# Altium project SpoolBot_drive_PCB.PrjPcb
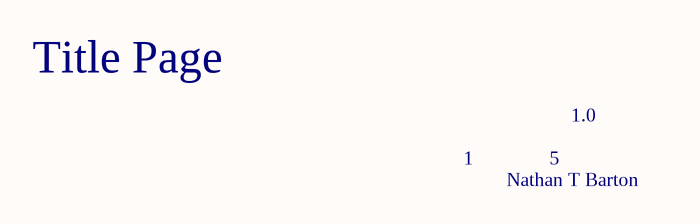
[diagram p0: SpoolBot_drive_PCB.SchDoc]
5 sheets, 36 parts. Net scope: global (net labels, ports and power ports of the same name join across sheets).
Board file: SpoolBot_drive_PCB.PcbDoc
Sheets:
  SpoolBot_drive_PCB.SchDoc
  DRV8840_driver.SchDoc
  Power_regulator.SchDoc
  MCU_ATmega4809.SchDoc
  Connectors.SchDoc

## Sheet SpoolBot_drive_PCB.SchDoc
size A; DocumentNumber: 1; SheetNumber: 1; SheetTotal: 5

### Notes on the sheet
- Title Page
- 1
- 5
- 1.0
- Nathan T Barton

## Sheet DRV8840_driver.SchDoc: Motor Driver
size A; DocumentNumber: 2; SheetNumber: 2; SheetTotal: 5
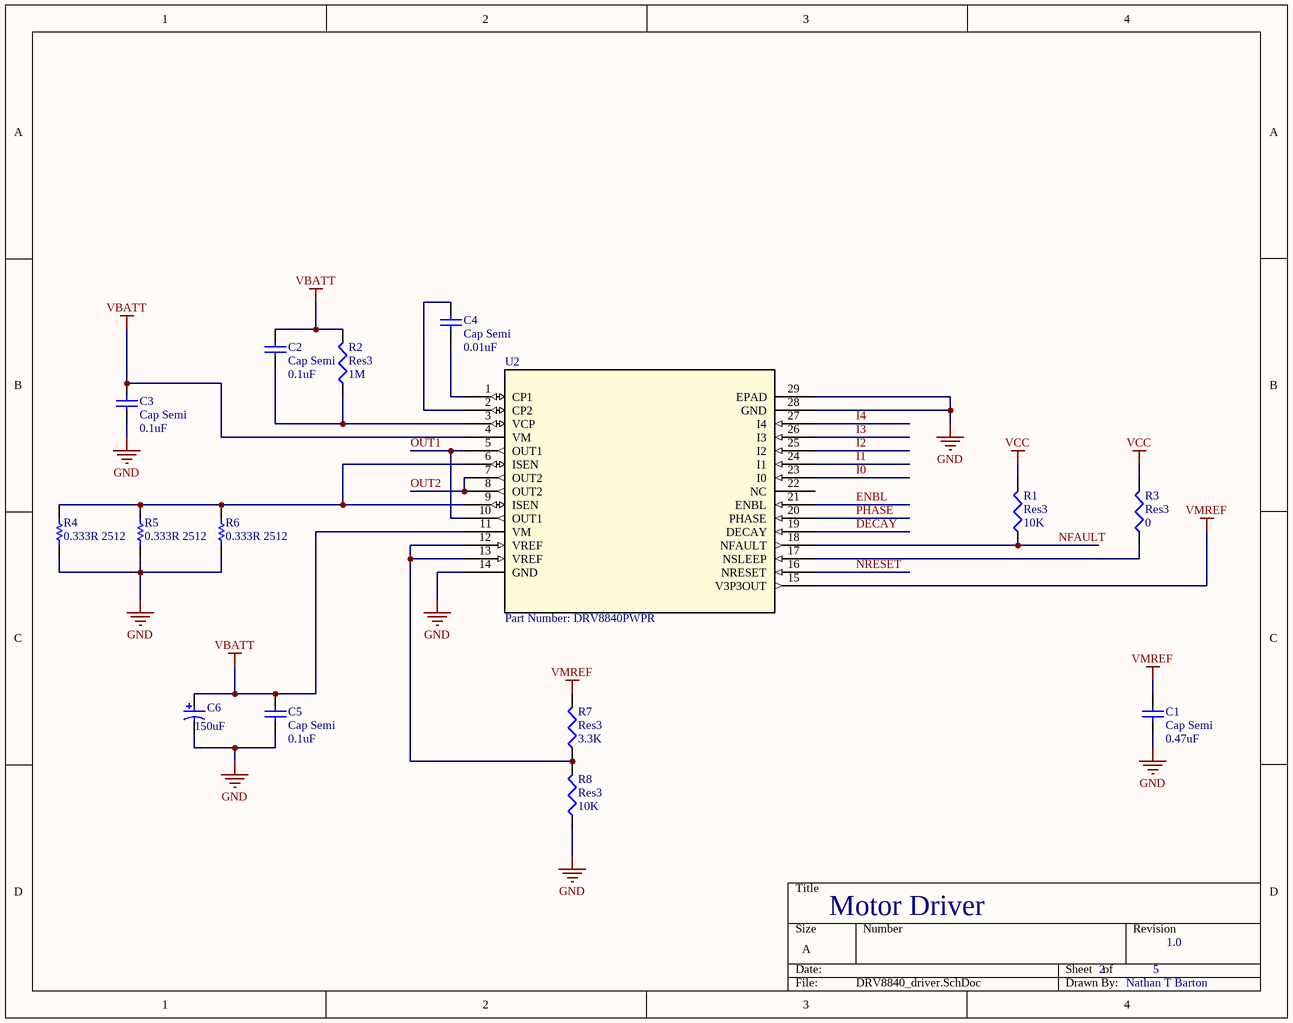
[diagram p1: DRV8840_driver.SchDoc]

### Parts
C1  Cap Semi  value 0.47uF  [C1206]
C2  Cap Semi  value 0.1uF  [C1206]
C3  Cap Semi  value 0.1uF  [C1206]
C4  Cap Semi  value 0.01uF  [C1206]
C5  Cap Semi  value 0.1uF  [C1206]
C6  150uF  [NIC-CAPA2-10X10_V]
R1  Res3  value 10K  [J1-0603]
R2  Res3  value 1M  [J1-0603]
R3  Res3  value 0  [J1-0603]
R4  0.333R 2512  [RESC2512(6432)_M]
R5  0.333R 2512  [RESC2512(6432)_M]
R6  0.333R 2512  [RESC2512(6432)_M]
R7  Res3  value 3.3K  [J1-0603]
R8  Res3  value 10K  [J1-0603]
U2  Part Number: DRV8840PWPR  [PWP28_5P18X3P1]

### Nets
GND: C1.1 C3.1 C5.1 C6.2 R4.1 R5.1 R6.1 R8.1 U2.14(GND) U2.28(GND) U2.29(EPAD)
VBATT: C2.2 C3.2 C5.2 C6.1 R2.2 U2.4(VM) U2.11(VM)
VCC: R1.2 R3.2
VMREF: C1.2 R7.2 U2.15(V3P3OUT)
DECAY: U2.19(DECAY)
ENBL: U2.21(ENBL)
I0: U2.23(I0)
I1: U2.24(I1)
I2: U2.25(I2)
I3: U2.26(I3)
I4: U2.27(I4)
NFAULT: R1.1 U2.18(NFAULT)
NRESET: U2.16(NRESET)
OUT1: U2.5(OUT1) U2.10(OUT1)
OUT2: U2.7(OUT2) U2.8(OUT2)
PHASE: U2.20(PHASE)
NetC2_1: C2.1 R2.1 U2.3(VCP)
NetC4_1: C4.1 U2.1(CP1)
NetC4_2: C4.2 U2.2(CP2)
NetR3_1: R3.1 U2.17(NSLEEP)
NetR4_2: R4.2 R5.2 R6.2 U2.6(ISEN) U2.9(ISEN)
NetR7_1: R7.1 R8.2 U2.12(VREF) U2.13(VREF)

Not connected (* = marked no-connect by the designer): U2 22(NC)

### Notes on the sheet
- Motor Driver
- 2
- 5
- 1.0
- Nathan T Barton

### Library data of the parts
C1-C5 = Cap Semi: Capacitor (Semiconductor SIM Model); Published: 8-Jun-2000; LatestRevisionDate: 29-May-2009; LatestRevisionNote: IPC-7351 Footprint Added.; PackageReference: C1206; Publisher: Altium Limited; PackageDescription: Chip Capacitor
C6 = CMP-0687-00003-1: Aluminum Electrolytic Capacitor, UD Series, Low Impedance, 150 uF, 50 V, + / - 20%, -55 to 105 degC, Chip Type, 10 x 10 mm D x L, Pb-Free, Reel; Manufacturer: Nichicon; PartNumber: UUD1H151MNL1GS; Rated Ripple Current (at 100kHz): 670 mA; Impedance: 0.18 Ohm; Packing: Dia382mm Reel; Tolerance Rated Capacitance: -20 to 20%; Rated Voltage: 50 V; Endurance Time: 5000 h; ComponentLink3URL: http://products.nichicon.co.jp/en/pdf/XJA043/e-ud.pdf; ComponentLink1URL: http://www.nichicon.co.jp/; ComponentLink2Description: Datasheet; Diameter: 10 mm; Rated Capacitance: 150 uF; ComponentLink3Description: Package Specification; PackageDescription: 2-Pin Surface Mount Device, Diameter 10 mm, Height 10 mm, Pitch 8 mm; ComponentLink1Description: Manufacturer URL; DatasheetVersion: 08/2012; Length: 10 mm; PackageReference: CAPAE-D10H10; RoHS: TRUE; Mounting Technology: Surface Mount; ComponentLink2URL: http://products.nichicon.co.jp/en/pdf/XJA043/e-ud.pdf
R1-R3 R7 R8 = Res3: Resistor; Published: 8-Jun-2000; LatestRevisionDate: 29-May-2009; LatestRevisionNote: IPC-7351 Footprint Added.; PackageReference: J1-0603; Publisher: Altium Limited; PackageDescription: Chip Resistor
R4-R6 = CMP-1018-00171-1: 1R 1W 1% 2512 (6432 Metric)  SMD; Case-EIA: 2512; Value: 1.00 Ohm; Case-Metric: 6432; Tolerance: 1 %; Technology: SMT; Power: 1 W
U2 = DRV8840PWPR: No Description Available; Manufacturer: Texas Instruments; Built_By: EMA_UL_Team; Vendor: Texas Instruments; Manufacturer_Part_Number: DRV8840PWPR; Copyright: Copyright (C) 2018 Accelerated Designs. All rights reserved; RefDes: RefDes; Type: DEV; Value: Value

## Sheet Power_regulator.SchDoc
size A; DocumentNumber: 3; SheetNumber: 3; SheetTotal: 5
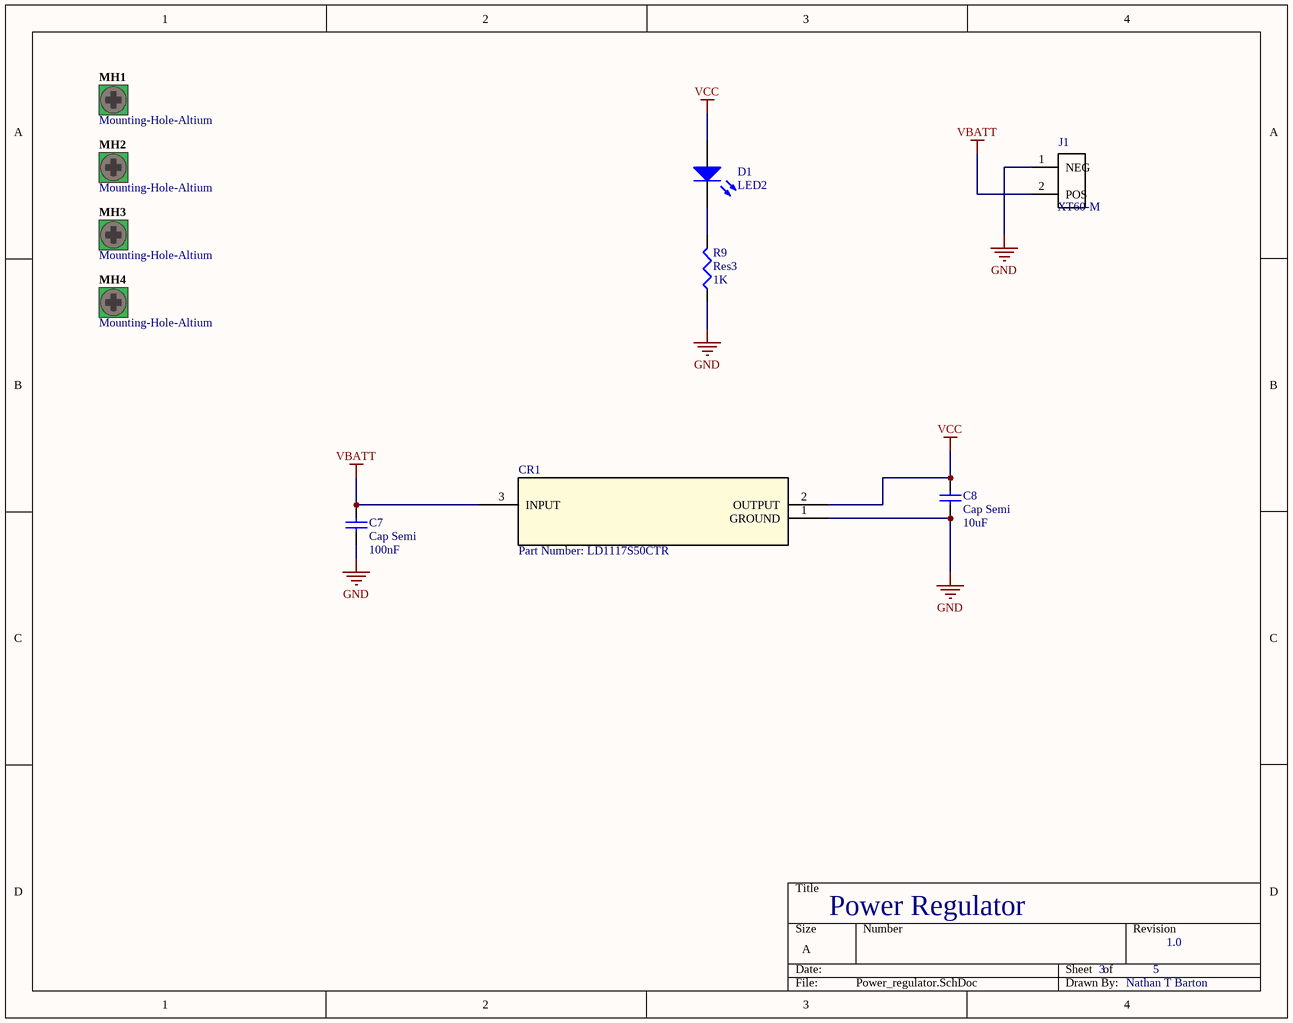
[diagram p2: Power_regulator.SchDoc]

### Parts
C7  Cap Semi  value 100nF  [C1206]
C8  Cap Semi  value 10uF  [C1206]
CR1  Part Number: LD1117S50CTR  [SOT-223]
D1  LED2  [3.2X1.6X1.1]
J1  XT60-M  [*AMASS_XT60-M]
MH1  Mounting-Hole-Altium  [Mounting-Hole-Altium]  (no BOM)
MH2  Mounting-Hole-Altium  [Mounting-Hole-Altium]  (no BOM)
MH3  Mounting-Hole-Altium  [Mounting-Hole-Altium]  (no BOM)
MH4  Mounting-Hole-Altium  [Mounting-Hole-Altium]  (no BOM)
R9  Res3  value 1K  [J1-0603]

### Nets
GND: C7.1 C8.1 CR1.1(GROUND) J1.1(NEG) R9.1
VBATT: C7.2 CR1.3(INPUT) J1.2(POS)
VCC: C8.2 CR1.2(OUTPUT) D1.1(A)
NetD1_2: D1.2(K) R9.2

Not connected (* = marked no-connect by the designer): MH1 1; MH2 1; MH3 1; MH4 1

### Notes on the sheet
- Power Regulator
- 3
- 5
- 1.0
- Nathan T Barton

### Library data of the parts
C7 C8 = Cap Semi: Capacitor (Semiconductor SIM Model); Published: 8-Jun-2000; LatestRevisionDate: 29-May-2009; LatestRevisionNote: IPC-7351 Footprint Added.; PackageReference: C1206; Publisher: Altium Limited; PackageDescription: Chip Capacitor
CR1 = LD1117S50CTR: No Description Available; Vendor: STMicroelectronics; Built_By: EMA_UL_Team; Type: DEV; Manufacturer_Part_Number: LD1117S50CTR; Copyright: Copyright (C) 2018 Accelerated Designs. All rights reserved; RefDes: RefDes; Value: Value
D1 = LED2: Typical RED, GREEN, YELLOW, AMBER GaAs LED; Published: 8-Jun-2000; LatestRevisionDate: 17-Jul-2002; LatestRevisionNote: Re-released for DXP Platform.; PackageVersion: Feb-2002; PackageReference: 3.2X1.6X1.1; Publisher: Altium Limited; PackageDescription: SM LED; 2 Flat Leads
J1 = XT60-M: MF: AMASS; Availability: Unavailable; Package: Package Analog Devices; SnapEDA_Link: https://www.snapeda.com/parts/XT60-M/AMASS/view-part/?ref=snap; MP: XT60-M; Price: None; Value: *
MH1-MH4 = CMP-0001-00027-1: Mounting Hole, Altium, 3.8mm pad, 3.4mm plated hole; ClassName: Mounting Hole; Publisher: Altium
R9 = Res3: Resistor; Published: 8-Jun-2000; LatestRevisionDate: 29-May-2009; LatestRevisionNote: IPC-7351 Footprint Added.; PackageReference: J1-0603; Publisher: Altium Limited; PackageDescription: Chip Resistor

## Sheet MCU_ATmega4809.SchDoc
size A; DocumentNumber: 4; SheetNumber: 4; SheetTotal: 5
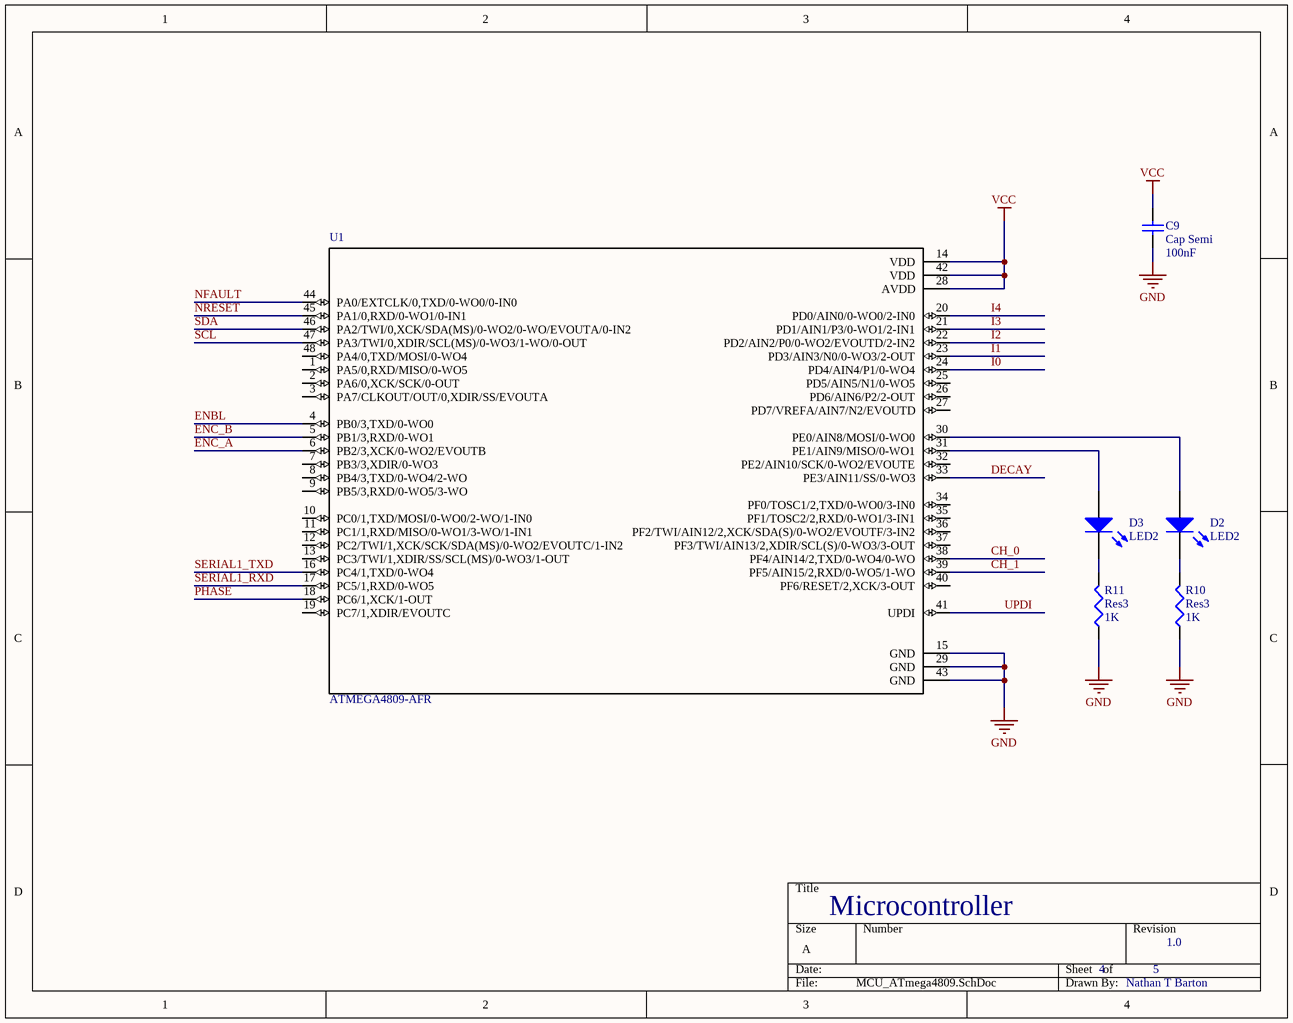
[diagram p3: MCU_ATmega4809.SchDoc]

### Parts
C9  Cap Semi  value 100nF  [C1206]
D2  LED2  [3.2X1.6X1.1]
D3  LED2  [3.2X1.6X1.1]
R10  Res3  value 1K  [J1-0603]
R11  Res3  value 1K  [J1-0603]
U1  ATMEGA4809-AFR  [*QFP50P900X900X120-48N]

### Nets
GND: C9.1 R10.1 R11.1 U1.15(GND) U1.29(GND) U1.43(GND)
VCC: C9.2 U1.14(VDD) U1.28(AVDD) U1.42(VDD)
CH_0: U1.38(PF4/AIN14/2,TXD/0-WO4/0-WO)
CH_1: U1.39(PF5/AIN15/2,RXD/0-WO5/1-WO)
DECAY: U1.33(PE3/AIN11/SS/0-WO3)
ENBL: U1.4(PB0/3,TXD/0-WO0)
ENC_A: U1.6(PB2/3,XCK/0-WO2/EVOUTB)
ENC_B: U1.5(PB1/3,RXD/0-WO1)
I0: U1.24(PD4/AIN4/P1/0-WO4)
I1: U1.23(PD3/AIN3/N0/0-WO3/2-OUT)
I2: U1.22(PD2/AIN2/P0/0-WO2/EVOUTD/2-IN2)
I3: U1.21(PD1/AIN1/P3/0-WO1/2-IN1)
I4: U1.20(PD0/AIN0/0-WO0/2-IN0)
NFAULT: U1.44(PA0/EXTCLK/0,TXD/0-WO0/0-IN0)
NRESET: U1.45(PA1/0,RXD/0-WO1/0-IN1)
PHASE: U1.18(PC6/1,XCK/1-OUT)
SCL: U1.47(PA3/TWI/0,XDIR/SCL(MS)/0-WO3/1-WO/0-OUT)
SDA: U1.46(PA2/TWI/0,XCK/SDA(MS)/0-WO2/0-WO/EVOUTA/0-IN2)
SERIAL1_RXD: U1.17(PC5/1,RXD/0-WO5)
SERIAL1_TXD: U1.16(PC4/1,TXD/0-WO4)
UPDI: U1.41(UPDI)
NetD2_1: D2.1(A) U1.30(PE0/AIN8/MOSI/0-WO0)
NetD2_2: D2.2(K) R10.2
NetD3_1: D3.1(A) U1.31(PE1/AIN9/MISO/0-WO1)
NetD3_2: D3.2(K) R11.2

Not connected (* = marked no-connect by the designer): U1 1(PA5/0,RXD/MISO/0-WO5) 2(PA6/0,XCK/SCK/0-OUT) 3(PA7/CLKOUT/OUT/0,XDIR/SS/EVOUTA) 7(PB3/3,XDIR/0-WO3) 8(PB4/3,TXD/0-WO4/2-WO) 9(PB5/3,RXD/0-WO5/3-WO) 10(PC0/1,TXD/MOSI/0-WO0/2-WO/1-IN0) 11(PC1/1,RXD/MISO/0-WO1/3-WO/1-IN1) 12(PC2/TWI/1,XCK/SCK/SDA(MS)/0-WO2/EVOUTC/1-IN2) 13(PC3/TWI/1,XDIR/SS/SCL(MS)/0-WO3/1-OUT) 19(PC7/1,XDIR/EVOUTC) 25(PD5/AIN5/N1/0-WO5) 26(PD6/AIN6/P2/2-OUT) 27(PD7/VREFA/AIN7/N2/EVOUTD) 32(PE2/AIN10/SCK/0-WO2/EVOUTE) 34(PF0/TOSC1/2,TXD/0-WO0/3-IN0) 35(PF1/TOSC2/2,RXD/0-WO1/3-IN1) 36(PF2/TWI/AIN12/2,XCK/SDA(S)/0-WO2/EVOUTF/3-IN2) 37(PF3/TWI/AIN13/2,XDIR/SCL(S)/0-WO3/3-OUT) 40(PF6/RESET/2,XCK/3-OUT) 48(PA4/0,TXD/MOSI/0-WO4)

### Notes on the sheet
- Microcontroller
- 4
- 5
- 1.0
- Nathan T Barton

### Library data of the parts
C9 = Cap Semi: Capacitor (Semiconductor SIM Model); Published: 8-Jun-2000; LatestRevisionDate: 29-May-2009; LatestRevisionNote: IPC-7351 Footprint Added.; PackageReference: C1206; Publisher: Altium Limited; PackageDescription: Chip Capacitor
D2 D3 = LED2: as D1 on sheet Power_regulator; Published: 8-Jun-2000; LatestRevisionDate: 17-Jul-2002; LatestRevisionNote: Re-released for DXP Platform.; PackageVersion: Feb-2002; PackageReference: 3.2X1.6X1.1; Publisher: Altium Limited; PackageDescription: SM LED; 2 Flat Leads
R10 R11 = Res3: Resistor; Published: 8-Jun-2000; LatestRevisionDate: 29-May-2009; LatestRevisionNote: IPC-7351 Footprint Added.; PackageReference: J1-0603; Publisher: Altium Limited; PackageDescription: Chip Resistor
U1 = ATMEGA4809-AFR: 20MHz 48KB TQFP48 Ind 125C Green T&R; MF: Microchip; Package: TQFP-48 Microchip; Price: None; Availability: Unavailable; MP: ATMEGA4809-AFR; SnapEDA_Link: https://www.snapeda.com/parts/ATMEGA4809-AFR/Microchip/view-part/?ref=snap; Value: *

## Sheet Connectors.SchDoc
size A; DocumentNumber: 5; SheetNumber: 5; SheetTotal: 5
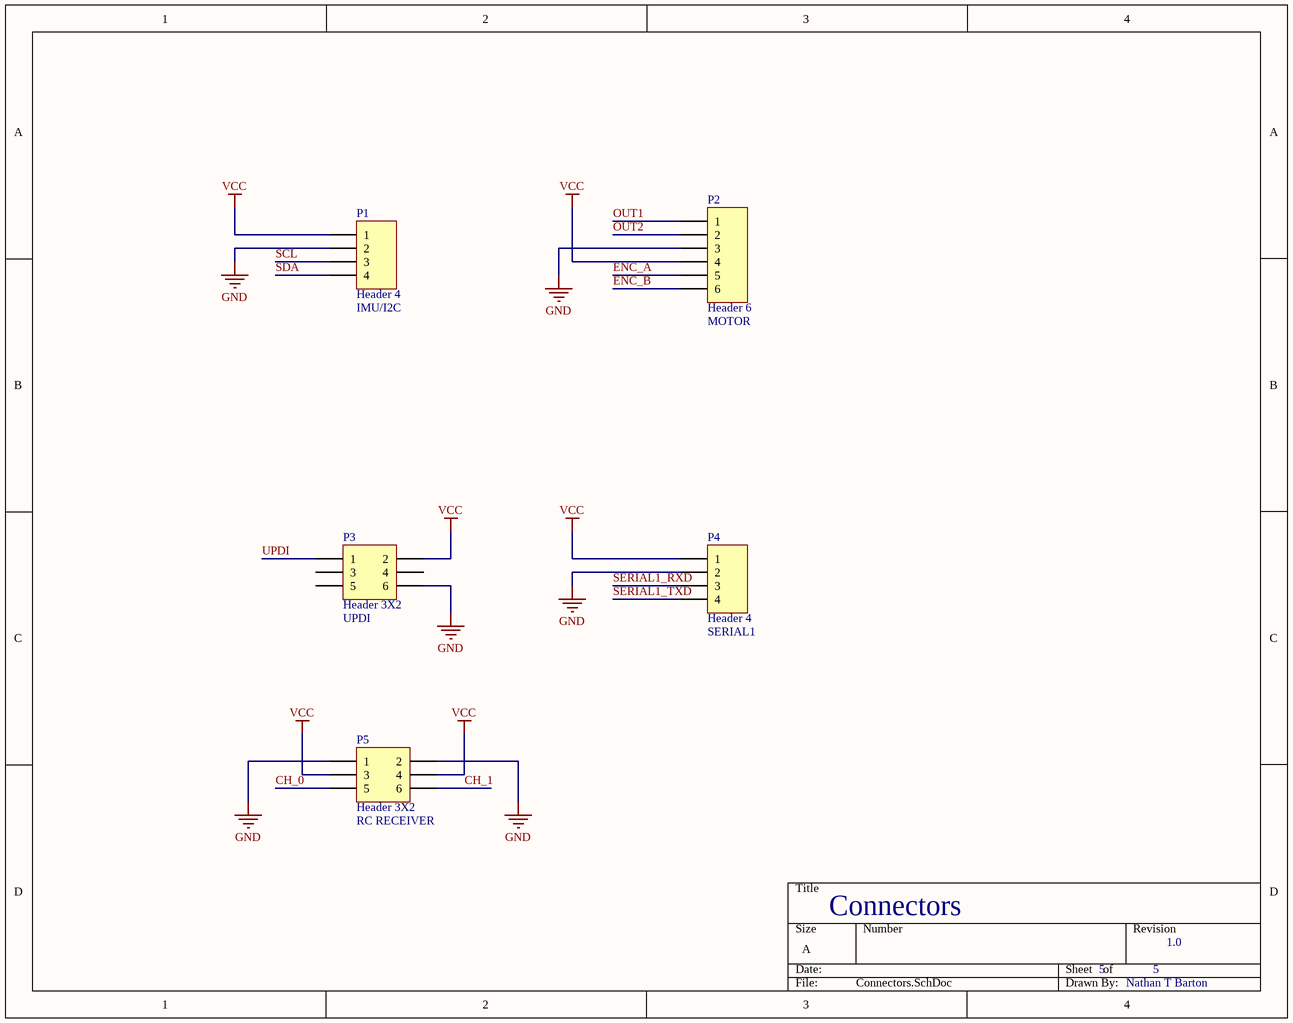
[diagram p4: Connectors.SchDoc]

### Parts
P1  Header 4  [HDR1X4]
P2  Header 6  [HDR1X6]
P3  Header 3X2  [HDR2X3]
P4  Header 4  [HDR1X4]
P5  Header 3X2  [HDR2X3]

### Nets
GND: P1.2 P2.3 P3.6 P4.2 P5.1 P5.2
VCC: P1.1 P2.4 P3.2 P4.1 P5.3 P5.4
CH_0: P5.5
CH_1: P5.6
ENC_A: P2.5
ENC_B: P2.6
OUT1: P2.1
OUT2: P2.2
SCL: P1.3
SDA: P1.4
SERIAL1_RXD: P4.3
SERIAL1_TXD: P4.4
UPDI: P3.1

Not connected (* = marked no-connect by the designer): P3 3 4 5

### Notes on the sheet
- (near P1) IMU/I2C
- (near P2) MOTOR
- (near P3) UPDI
- (near P4) SERIAL1
- (near P5) RC RECEIVER
- Connectors
- 5
- 1.0
- Nathan T Barton

### Library data of the parts
P1 P4 = Header 4: Header, 4-Pin; LatestRevisionDate: 17-Jul-2002; LatestRevisionNote: Re-released for DXP Platform.; Publisher: Altium Limited
P2 = Header 6: Header, 6-Pin; LatestRevisionDate: 17-Jul-2002; LatestRevisionNote: Re-released for DXP Platform.; Publisher: Altium Limited
P3 P5 = Header 3X2: Header, 3-Pin, Dual row; LatestRevisionDate: 17-Jul-2002; LatestRevisionNote: Re-released for DXP Platform.; Publisher: Altium Limited

## Nets that join several sheets
GND: DRV8840_driver (11 pins), Power_regulator (5 pins), MCU_ATmega4809 (6 pins), Connectors (6 pins)
VBATT: DRV8840_driver (7 pins), Power_regulator (C7.2 CR1.3 J1.2)
VCC: DRV8840_driver (R1.2 R3.2), Power_regulator (C8.2 CR1.2 D1.1), MCU_ATmega4809 (C9.2 U1.14 U1.28 U1.42), Connectors (6 pins)
CH_0: MCU_ATmega4809 (U1.38), Connectors (P5.5)
CH_1: MCU_ATmega4809 (U1.39), Connectors (P5.6)
DECAY: DRV8840_driver (U2.19), MCU_ATmega4809 (U1.33)
ENBL: DRV8840_driver (U2.21), MCU_ATmega4809 (U1.4)
ENC_A: MCU_ATmega4809 (U1.6), Connectors (P2.5)
ENC_B: MCU_ATmega4809 (U1.5), Connectors (P2.6)
I0: DRV8840_driver (U2.23), MCU_ATmega4809 (U1.24)
I1: DRV8840_driver (U2.24), MCU_ATmega4809 (U1.23)
I2: DRV8840_driver (U2.25), MCU_ATmega4809 (U1.22)
I3: DRV8840_driver (U2.26), MCU_ATmega4809 (U1.21)
I4: DRV8840_driver (U2.27), MCU_ATmega4809 (U1.20)
NFAULT: DRV8840_driver (R1.1 U2.18), MCU_ATmega4809 (U1.44)
NRESET: DRV8840_driver (U2.16), MCU_ATmega4809 (U1.45)
OUT1: DRV8840_driver (U2.5 U2.10), Connectors (P2.1)
OUT2: DRV8840_driver (U2.7 U2.8), Connectors (P2.2)
PHASE: DRV8840_driver (U2.20), MCU_ATmega4809 (U1.18)
SCL: MCU_ATmega4809 (U1.47), Connectors (P1.3)
SDA: MCU_ATmega4809 (U1.46), Connectors (P1.4)
SERIAL1_RXD: MCU_ATmega4809 (U1.17), Connectors (P4.3)
SERIAL1_TXD: MCU_ATmega4809 (U1.16), Connectors (P4.4)
UPDI: MCU_ATmega4809 (U1.41), Connectors (P3.1)